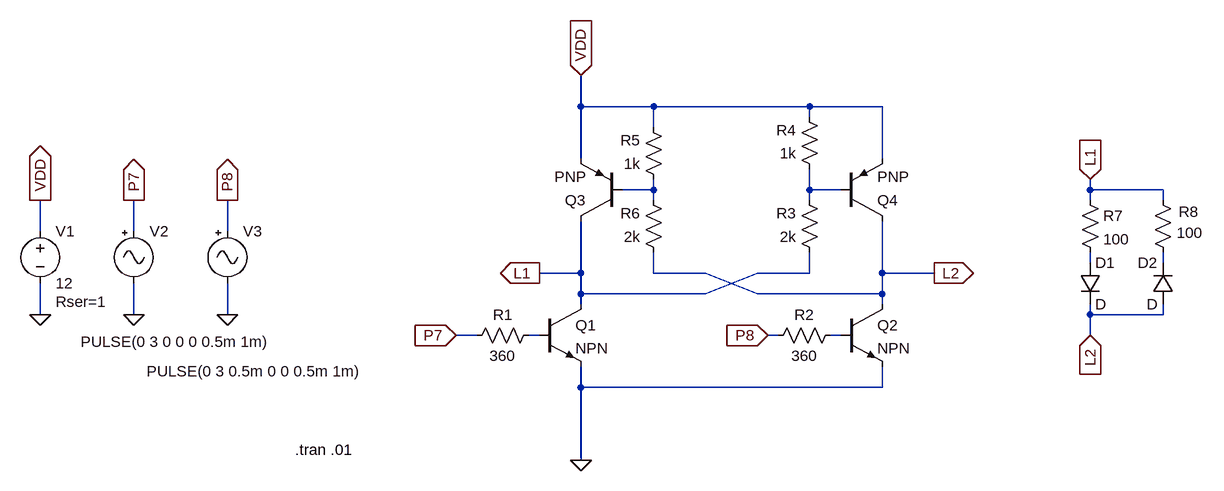
[diagram p0: schematic FairyLights.asc]
FairyLights.asc, the LTspice schematic file:
Version 4
SHEET 1 1144 680
WIRE 160 -240 160 -288
WIRE 272 -240 160 -240
WIRE 512 -240 272 -240
WIRE 624 -240 512 -240
WIRE 512 -224 512 -240
WIRE 272 -208 272 -240
WIRE 160 -160 160 -240
WIRE 624 -160 624 -240
WIRE 272 -112 272 -128
WIRE 272 -112 224 -112
WIRE 512 -112 512 -144
WIRE 560 -112 512 -112
WIRE 944 -112 944 -128
WIRE 1056 -112 944 -112
WIRE 272 -96 272 -112
WIRE 512 -96 512 -112
WIRE 944 -96 944 -112
WIRE 1056 -96 1056 -112
WIRE -672 -48 -672 -96
WIRE -528 -48 -528 -96
WIRE -384 -48 -384 -96
WIRE 944 0 944 -16
WIRE 1056 0 1056 -16
WIRE 160 16 160 -64
WIRE 160 16 96 16
WIRE 272 16 272 -16
WIRE 352 16 272 16
WIRE 512 16 512 -16
WIRE 512 16 432 16
WIRE 624 16 624 -64
WIRE 704 16 624 16
WIRE 160 48 160 16
WIRE 352 48 432 16
WIRE 352 48 160 48
WIRE 432 48 352 16
WIRE 624 48 624 16
WIRE 624 48 432 48
WIRE 160 64 160 48
WIRE 624 64 624 48
WIRE -672 80 -672 32
WIRE -528 80 -528 32
WIRE -384 80 -384 32
WIRE 944 80 944 64
WIRE 1056 80 1056 64
WIRE 1056 80 944 80
WIRE 0 112 -32 112
WIRE 96 112 80 112
WIRE 464 112 448 112
WIRE 560 112 544 112
WIRE 944 112 944 80
WIRE 160 192 160 160
WIRE 624 192 624 160
WIRE 624 192 160 192
WIRE 160 304 160 192
FLAG -32 112 P7
IOPIN -32 112 In
FLAG 448 112 P8
IOPIN 448 112 In
FLAG 160 304 0
FLAG 96 16 L1
IOPIN 96 16 Out
FLAG 704 16 L2
IOPIN 704 16 Out
FLAG 160 -288 VDD
IOPIN 160 -288 In
FLAG -672 -96 VDD
IOPIN -672 -96 Out
FLAG -672 80 0
FLAG 944 -128 L1
IOPIN 944 -128 In
FLAG 944 112 L2
IOPIN 944 112 In
FLAG -528 -96 P7
IOPIN -528 -96 Out
FLAG -528 80 0
FLAG -384 -96 P8
IOPIN -384 -96 Out
FLAG -384 80 0
SYMBOL npn 96 64 R0
SYMATTR InstName Q1
SYMBOL npn 560 64 R0
SYMATTR InstName Q2
SYMBOL pnp 224 -64 R180
SYMATTR InstName Q3
SYMBOL pnp 560 -64 M180
SYMATTR InstName Q4
SYMBOL res 96 96 R90
WINDOW 0 0 56 VBottom 2
WINDOW 3 32 56 VTop 2
SYMATTR InstName R1
SYMATTR Value 360
SYMBOL res 560 96 R90
WINDOW 0 0 56 VBottom 2
WINDOW 3 32 56 VTop 2
SYMATTR InstName R2
SYMATTR Value 360
SYMBOL res 288 -112 R180
WINDOW 0 36 76 Left 2
WINDOW 3 36 40 Left 2
SYMATTR InstName R5
SYMATTR Value 1k
SYMBOL res 288 0 R180
WINDOW 0 36 76 Left 2
WINDOW 3 36 40 Left 2
SYMATTR InstName R6
SYMATTR Value 2k
SYMBOL res 528 0 R180
WINDOW 0 36 76 Left 2
WINDOW 3 36 40 Left 2
SYMATTR InstName R3
SYMATTR Value 2k
SYMBOL res 528 -128 R180
WINDOW 0 36 76 Left 2
WINDOW 3 36 40 Left 2
SYMATTR InstName R4
SYMATTR Value 1k
SYMBOL voltage -672 -64 R0
WINDOW 123 0 0 Left 0
WINDOW 39 24 124 Left 2
SYMATTR InstName V1
SYMATTR Value 12
SYMATTR SpiceLine Rser=1
SYMBOL res 928 -112 R0
SYMATTR InstName R7
SYMATTR Value 100
SYMBOL res 1072 0 R180
WINDOW 0 -39 78 Left 2
WINDOW 3 -46 46 Left 2
SYMATTR InstName R8
SYMATTR Value 100
SYMBOL diode 928 0 R0
SYMATTR InstName D1
SYMBOL diode 1072 64 R180
WINDOW 0 24 64 Left 2
WINDOW 3 24 0 Left 2
SYMATTR InstName D2
SYMBOL Misc\\signal -528 -64 R0
WINDOW 3 -82 186 Left 2
WINDOW 123 0 0 Left 0
WINDOW 39 0 0 Left 0
SYMATTR InstName V2
SYMATTR Value PULSE(0 3 0 0 0 0.5m 1m)
SYMBOL Misc\\signal -384 -64 R0
WINDOW 3 -124 231 Left 2
WINDOW 123 0 0 Left 0
WINDOW 39 0 0 Left 0
SYMATTR InstName V3
SYMATTR Value PULSE(0 3 0.5m 0 0 0.5m 1m)
TEXT -280 288 Left 2 !.tran .01

The netlist it stands for:
* FairyLights.asc
Q1 L1 N005 0 0 NPN
Q2 L2 N006 0 0 NPN
Q3 L1 N001 VDD 0 PNP
Q4 L2 N002 VDD 0 PNP
R1 N005 P7 360
R2 N006 P8 360
R5 N001 VDD 1k
R6 L2 N001 2k
R3 L1 N002 2k
R4 N002 VDD 1k
V1 VDD 0 12 Rser=1
R7 L1 N003 100
R8 N004 L1 100
D1 N003 L2 D
D2 L2 N004 D
V2 P7 0 PULSE(0 3 0 0 0 0.5m 1m)
V3 P8 0 PULSE(0 3 0.5m 0 0 0.5m 1m)
.model D D
.lib standard.dio
.model NPN NPN
.model PNP PNP
.lib standard.bjt
.tran .01
.backanno
.end